# Altium schematic sheet n24.SchDoc
size A3
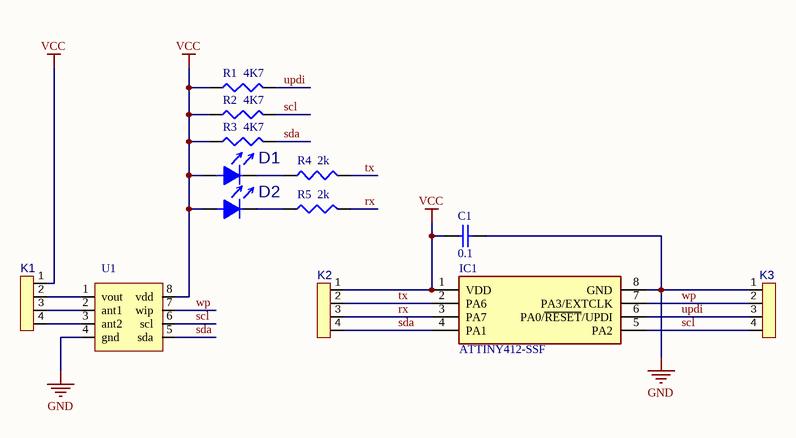
[diagram p0: n24.SchDoc]

## Parts
C1  value 0.1  [SM0805]  (hidden comment: cap0805)
D1  LIGHT_SM0805  [SM0805_diode]  (value not drawn)
D2  LIGHT_SM0805  [SM0805_diode]  (value not drawn)
IC1  ATTINY412-SSF  [SOIC127P600X175-8N]
K1  1x4PLS  [4_PLS_2.54]  (value not drawn)
K2  1x4PLS  [4_PLS_2.54]  (value not drawn)
K3  1x4PLS  [4_PLS_2.54]  (value not drawn)
R1  value 4K7  [SM0805]  (hidden comment: res0805)
R2  value 4K7  [SM0805]  (hidden comment: res0805)
R3  value 4K7  [SM0805]  (hidden comment: res0805)
R4  value 2k  [SM0805]  (hidden comment: res0805)
R5  value 2k  [SM0805]  (hidden comment: res0805)
U1  n24rf04  [SO8_L]  (value not drawn)

## Nets
GND: C1.2 IC1.8(GND) K3.1 U1.4(gnd)
VCC: C1.1 D1.1(a) D2.1(a) IC1.1(VDD) K1.1 K2.1 R1.1 R2.1 R3.1 U1.8(vdd)
rx: IC1.3(PA7) K2.3 R5.2
scl: IC1.5(PA2) K3.4 R2.2 U1.6(scl)
sda: IC1.4(PA1) K2.4 R3.2 U1.5(sda)
tx: IC1.2(PA6) K2.2 R4.2
updi: IC1.6(PA0/~{RESET}/UPDI) K3.3 R1.2
wp: IC1.7(PA3/EXTCLK) K3.2 U1.7(wip)
NetD1_2: D1.2(k) R4.1
NetD2_2: D2.2(k) R5.1
NetK1_2: K1.2 U1.1(vout)
NetK1_3: K1.3 U1.2(ant1)
NetK1_4: K1.4 U1.3(ant2)

## Library data of the parts
C1 = cap0805: Capacitor; Published: 8-Jun-2000; LatestRevisionDate: 17-Jul-2002; LatestRevisionNote: Re-released for DXP Platform.; PackageReference: RAD-0.3; Publisher: Altium Limited; PackageDescription: Radial Cap, Thru-Hole; 2 Leads; 0.3 in Pin Spacing
IC1 = ATTINY412-SSF: Integrated Circuit; Manufacturer_Name: Microchip; Datasheet Link: https://componentsearchengine.com/Datasheets/1/ATTINY412-SSF.pdf; Height: 1.75mm; Manufacturer_Part_Number: ATTINY412-SSF; Mouser Part Number: 579-ATTINY412-SSF; Mouser Price/Stock: https://www.mouser.co.uk/ProductDetail/Microchip-Technology/ATTINY412-SSF?qs=3HJ2avRr9PLjr%252BAvU6bmFQ%3D%3D; Arrow Part Number: ATTINY412-SSF; Arrow Price/Stock: https://www.arrow.com/en/products/attiny412-ssf/microchip-technology
K1-K3 = 1x4PLS: 1 row 4 pin 2.54mm; Value: *
R1-R5 = res0805: Resistor; Published: 8-Jun-2000; LatestRevisionDate: 29-May-2009; LatestRevisionNote: IPC-7351 Footprint Added.; PackageReference: J1-0603; Publisher: Altium Limited; PackageDescription: Chip Resistor
U1 = n24rf04: eeprom & nfc tag
D1 D2 = LIGHT_SM0805: Value: *